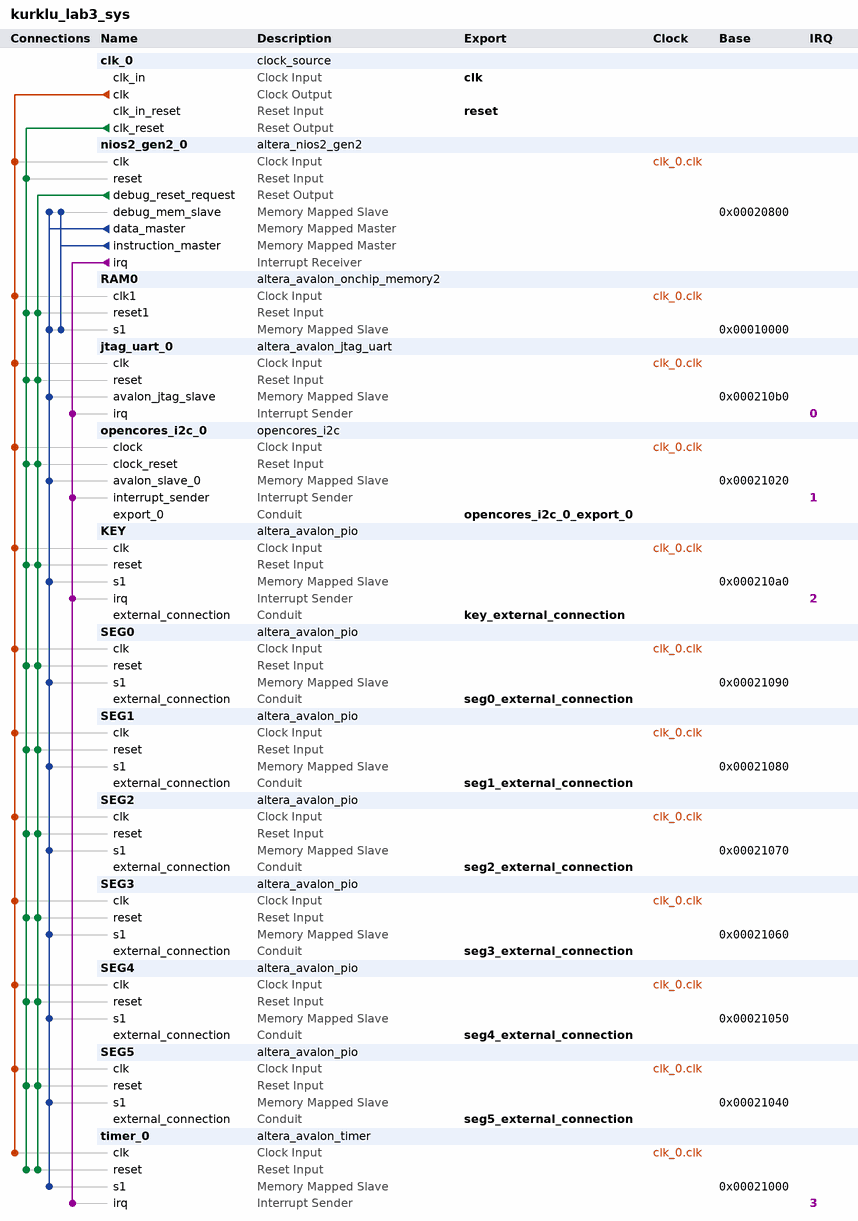
[diagram p0: system contents]
# Platform Designer (Qsys) system kurklu_lab3_sys, MAX 10 10M50DAF484C6GES
# Parameters at their usual value, and those the tool derives, are not listed.
package require -exact qsys 18.1
create_system kurklu_lab3_sys
set_project_property DEVICE_FAMILY {MAX 10}
set_project_property DEVICE 10M50DAF484C6GES

add_instance clk_0 clock_source 18.1
set_instance_parameter_value clk_0 clockFrequency 50000000

add_instance nios2_gen2_0 altera_nios2_gen2 18.1
set_instance_parameter_value nios2_gen2_0 dcache_size 2048
set_instance_parameter_value nios2_gen2_0 exceptionSlave RAM0.s1
set_instance_parameter_value nios2_gen2_0 icache_size 4096
set_instance_parameter_value nios2_gen2_0 impl Tiny
set_instance_parameter_value nios2_gen2_0 resetSlave RAM0.s1

add_instance RAM0 altera_avalon_onchip_memory2 18.1
set_instance_parameter_value RAM0 dataWidth 32
set_instance_parameter_value RAM0 dualPort false
set_instance_parameter_value RAM0 initMemContent true
set_instance_parameter_value RAM0 initializationFileName D:/Git/kurklu_lab3/software/app/mem_init/kurklu_lab3_sys_RAM0.hex
set_instance_parameter_value RAM0 memorySize 40960
set_instance_parameter_value RAM0 useNonDefaultInitFile true

add_instance jtag_uart_0 altera_avalon_jtag_uart 18.1
set_instance_parameter_value jtag_uart_0 simInteractiveOptions NO_INTERACTIVE_WINDOWS

add_instance opencores_i2c_0 opencores_i2c 9.1

add_instance KEY altera_avalon_pio 18.1
set_instance_parameter_value KEY bitClearingEdgeCapReg true
set_instance_parameter_value KEY captureEdge true
set_instance_parameter_value KEY direction Input
set_instance_parameter_value KEY generateIRQ true
set_instance_parameter_value KEY irqType EDGE
set_instance_parameter_value KEY width 1

add_instance SEG0 altera_avalon_pio 18.1
set_instance_parameter_value SEG0 direction Output
set_instance_parameter_value SEG0 width 7

add_instance SEG1 altera_avalon_pio 18.1
set_instance_parameter_value SEG1 direction Output
set_instance_parameter_value SEG1 width 7

add_instance SEG2 altera_avalon_pio 18.1
set_instance_parameter_value SEG2 direction Output
set_instance_parameter_value SEG2 width 7

add_instance SEG3 altera_avalon_pio 18.1
set_instance_parameter_value SEG3 direction Output
set_instance_parameter_value SEG3 width 7

add_instance SEG4 altera_avalon_pio 18.1
set_instance_parameter_value SEG4 direction Output
set_instance_parameter_value SEG4 width 7

add_instance SEG5 altera_avalon_pio 18.1
set_instance_parameter_value SEG5 direction Output
set_instance_parameter_value SEG5 width 7

add_instance timer_0 altera_avalon_timer 18.1
set_instance_parameter_value timer_0 period 1
set_instance_parameter_value timer_0 periodUnits SEC

# connections
add_connection clk_0.clk jtag_uart_0.clk clock
add_connection clk_0.clk KEY.clk clock
add_connection clk_0.clk nios2_gen2_0.clk clock
add_connection clk_0.clk opencores_i2c_0.clock clock
add_connection clk_0.clk RAM0.clk1 clock
add_connection clk_0.clk SEG0.clk clock
add_connection clk_0.clk SEG1.clk clock
add_connection clk_0.clk SEG2.clk clock
add_connection clk_0.clk SEG3.clk clock
add_connection clk_0.clk SEG4.clk clock
add_connection clk_0.clk SEG5.clk clock
add_connection clk_0.clk timer_0.clk clock
add_connection clk_0.clk_reset jtag_uart_0.reset reset
add_connection clk_0.clk_reset KEY.reset reset
add_connection clk_0.clk_reset nios2_gen2_0.reset reset
add_connection clk_0.clk_reset opencores_i2c_0.clock_reset reset
add_connection clk_0.clk_reset RAM0.reset1 reset
add_connection clk_0.clk_reset SEG0.reset reset
add_connection clk_0.clk_reset SEG1.reset reset
add_connection clk_0.clk_reset SEG2.reset reset
add_connection clk_0.clk_reset SEG3.reset reset
add_connection clk_0.clk_reset SEG4.reset reset
add_connection clk_0.clk_reset SEG5.reset reset
add_connection clk_0.clk_reset timer_0.reset reset
add_connection nios2_gen2_0.debug_reset_request jtag_uart_0.reset reset
add_connection nios2_gen2_0.debug_reset_request KEY.reset reset
add_connection nios2_gen2_0.debug_reset_request opencores_i2c_0.clock_reset reset
add_connection nios2_gen2_0.debug_reset_request RAM0.reset1 reset
add_connection nios2_gen2_0.debug_reset_request SEG0.reset reset
add_connection nios2_gen2_0.debug_reset_request SEG1.reset reset
add_connection nios2_gen2_0.debug_reset_request SEG2.reset reset
add_connection nios2_gen2_0.debug_reset_request SEG3.reset reset
add_connection nios2_gen2_0.debug_reset_request SEG4.reset reset
add_connection nios2_gen2_0.debug_reset_request SEG5.reset reset
add_connection nios2_gen2_0.debug_reset_request timer_0.reset reset
add_connection nios2_gen2_0.data_master jtag_uart_0.avalon_jtag_slave avalon
set_connection_parameter_value nios2_gen2_0.data_master/jtag_uart_0.avalon_jtag_slave baseAddress 0x000210b0
add_connection nios2_gen2_0.data_master KEY.s1 avalon
set_connection_parameter_value nios2_gen2_0.data_master/KEY.s1 baseAddress 0x000210a0
add_connection nios2_gen2_0.data_master nios2_gen2_0.debug_mem_slave avalon
set_connection_parameter_value nios2_gen2_0.data_master/nios2_gen2_0.debug_mem_slave baseAddress 0x00020800
add_connection nios2_gen2_0.data_master opencores_i2c_0.avalon_slave_0 avalon
set_connection_parameter_value nios2_gen2_0.data_master/opencores_i2c_0.avalon_slave_0 baseAddress 0x00021020
add_connection nios2_gen2_0.data_master RAM0.s1 avalon
set_connection_parameter_value nios2_gen2_0.data_master/RAM0.s1 baseAddress 0x00010000
add_connection nios2_gen2_0.data_master SEG0.s1 avalon
set_connection_parameter_value nios2_gen2_0.data_master/SEG0.s1 baseAddress 0x00021090
add_connection nios2_gen2_0.data_master SEG1.s1 avalon
set_connection_parameter_value nios2_gen2_0.data_master/SEG1.s1 baseAddress 0x00021080
add_connection nios2_gen2_0.data_master SEG2.s1 avalon
set_connection_parameter_value nios2_gen2_0.data_master/SEG2.s1 baseAddress 0x00021070
add_connection nios2_gen2_0.data_master SEG3.s1 avalon
set_connection_parameter_value nios2_gen2_0.data_master/SEG3.s1 baseAddress 0x00021060
add_connection nios2_gen2_0.data_master SEG4.s1 avalon
set_connection_parameter_value nios2_gen2_0.data_master/SEG4.s1 baseAddress 0x00021050
add_connection nios2_gen2_0.data_master SEG5.s1 avalon
set_connection_parameter_value nios2_gen2_0.data_master/SEG5.s1 baseAddress 0x00021040
add_connection nios2_gen2_0.data_master timer_0.s1 avalon
set_connection_parameter_value nios2_gen2_0.data_master/timer_0.s1 baseAddress 0x00021000
add_connection nios2_gen2_0.instruction_master nios2_gen2_0.debug_mem_slave avalon
set_connection_parameter_value nios2_gen2_0.instruction_master/nios2_gen2_0.debug_mem_slave baseAddress 0x00020800
add_connection nios2_gen2_0.instruction_master RAM0.s1 avalon
set_connection_parameter_value nios2_gen2_0.instruction_master/RAM0.s1 baseAddress 0x00010000
add_connection nios2_gen2_0.irq jtag_uart_0.irq interrupt
set_connection_parameter_value nios2_gen2_0.irq/jtag_uart_0.irq irqNumber 0
add_connection nios2_gen2_0.irq KEY.irq interrupt
set_connection_parameter_value nios2_gen2_0.irq/KEY.irq irqNumber 2
add_connection nios2_gen2_0.irq opencores_i2c_0.interrupt_sender interrupt
set_connection_parameter_value nios2_gen2_0.irq/opencores_i2c_0.interrupt_sender irqNumber 1
add_connection nios2_gen2_0.irq timer_0.irq interrupt
set_connection_parameter_value nios2_gen2_0.irq/timer_0.irq irqNumber 3

# exported interfaces
add_interface clk clock sink
set_interface_property clk EXPORT_OF clk_0.clk_in
add_interface key_external_connection conduit end
set_interface_property key_external_connection EXPORT_OF KEY.external_connection
add_interface opencores_i2c_0_export_0 conduit end
set_interface_property opencores_i2c_0_export_0 EXPORT_OF opencores_i2c_0.export_0
add_interface reset reset sink
set_interface_property reset EXPORT_OF clk_0.clk_in_reset
add_interface seg0_external_connection conduit end
set_interface_property seg0_external_connection EXPORT_OF SEG0.external_connection
add_interface seg1_external_connection conduit end
set_interface_property seg1_external_connection EXPORT_OF SEG1.external_connection
add_interface seg2_external_connection conduit end
set_interface_property seg2_external_connection EXPORT_OF SEG2.external_connection
add_interface seg3_external_connection conduit end
set_interface_property seg3_external_connection EXPORT_OF SEG3.external_connection
add_interface seg4_external_connection conduit end
set_interface_property seg4_external_connection EXPORT_OF SEG4.external_connection
add_interface seg5_external_connection conduit end
set_interface_property seg5_external_connection EXPORT_OF SEG5.external_connection

set_interconnect_requirement {$system} qsys_mm.clockCrossingAdapter HANDSHAKE
set_interconnect_requirement {$system} qsys_mm.enableEccProtection FALSE
set_interconnect_requirement {$system} qsys_mm.insertDefaultSlave FALSE
set_interconnect_requirement {$system} qsys_mm.maxAdditionalLatency 1

save_system kurklu_lab3_sys.qsys
